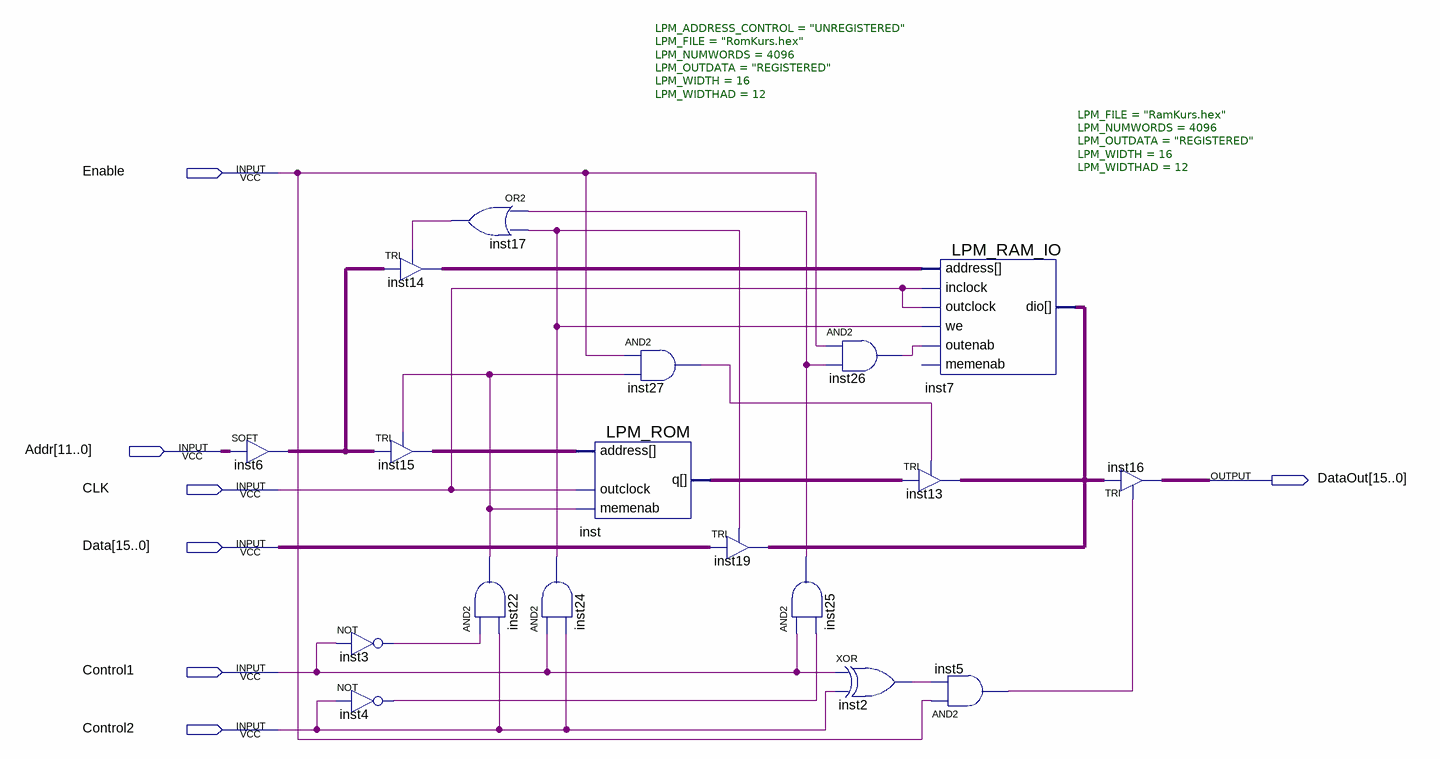
[diagram p0: schematic sheet]
// Quartus schematic Memblock.bdf as structural Verilog: 18 symbols, 7 pins
module Memblock (
  input  Enable,
  input  [11:0] Addr,
  input  CLK,
  input  [15:0] Data,
  input  Control1,
  input  Control2,
  output [15:0] DataOut
);

  wire inst2_out, inst3_out, inst4_out, inst5_out, inst17_out, inst22_out, inst24_out, inst25_out,
       inst26_out, inst27_out;
  wire [11:0] inst6_out, inst14_out, inst15_out;
  wire [15:0] inst19_out, inst_q;

  SOFT inst6[11:0] (.IN(Addr), .OUT(inst6_out));
  TRI inst14[11:0] (.IN(inst6_out), .OE(inst17_out), .OUT(inst14_out));
  TRI inst15[11:0] (.IN(inst6_out), .OE(inst22_out), .OUT(inst15_out));
  not inst3 (inst3_out, Control1);
  not inst4 (inst4_out, Control2);
  or inst17 (inst17_out, inst25_out, inst24_out);
  and inst22 (inst22_out, inst3_out, Control2);
  and inst24 (inst24_out, Control1, Control2);
  LPM_ROM #(.LPM_ADDRESS_CONTROL("UNREGISTERED"), .LPM_FILE("RomKurs.hex"), .LPM_NUMWORDS(4096), .LPM_OUTDATA("REGISTERED"), .LPM_WIDTH(16), .LPM_WIDTHAD(12)) inst (
    .address(inst15_out), .outclock(CLK), .memenab(inst22_out), .q(inst_q));
  and inst27 (inst27_out, Enable, inst22_out);
  TRI inst19[15:0] (.IN(Data), .OE(inst24_out), .OUT(inst19_out));
  and inst26 (inst26_out, Enable, inst25_out);
  and inst25 (inst25_out, Control1, inst4_out);
  xor inst2 (inst2_out, Control1, Control2);
  LPM_RAM_IO #(.LPM_FILE("RamKurs.hex"), .LPM_NUMWORDS(4096), .LPM_OUTDATA("REGISTERED"), .LPM_WIDTH(16), .LPM_WIDTHAD(12)) inst7 (
    .address(inst14_out), .outclock(CLK), .inclock(CLK), .we(inst24_out), .outenab(inst26_out),
    .dio(inst19_out));  // open: memenab
  TRI inst13[15:0] (.IN(inst_q), .OE(inst27_out), .OUT(inst19_out));
  and inst5 (inst5_out, Enable, inst2_out);
  TRI inst16[15:0] (.IN(inst19_out), .OE(inst5_out), .OUT(DataOut));
endmodule
